# EAGLE design EnsembleSeven (EAGLE 7.6.0)
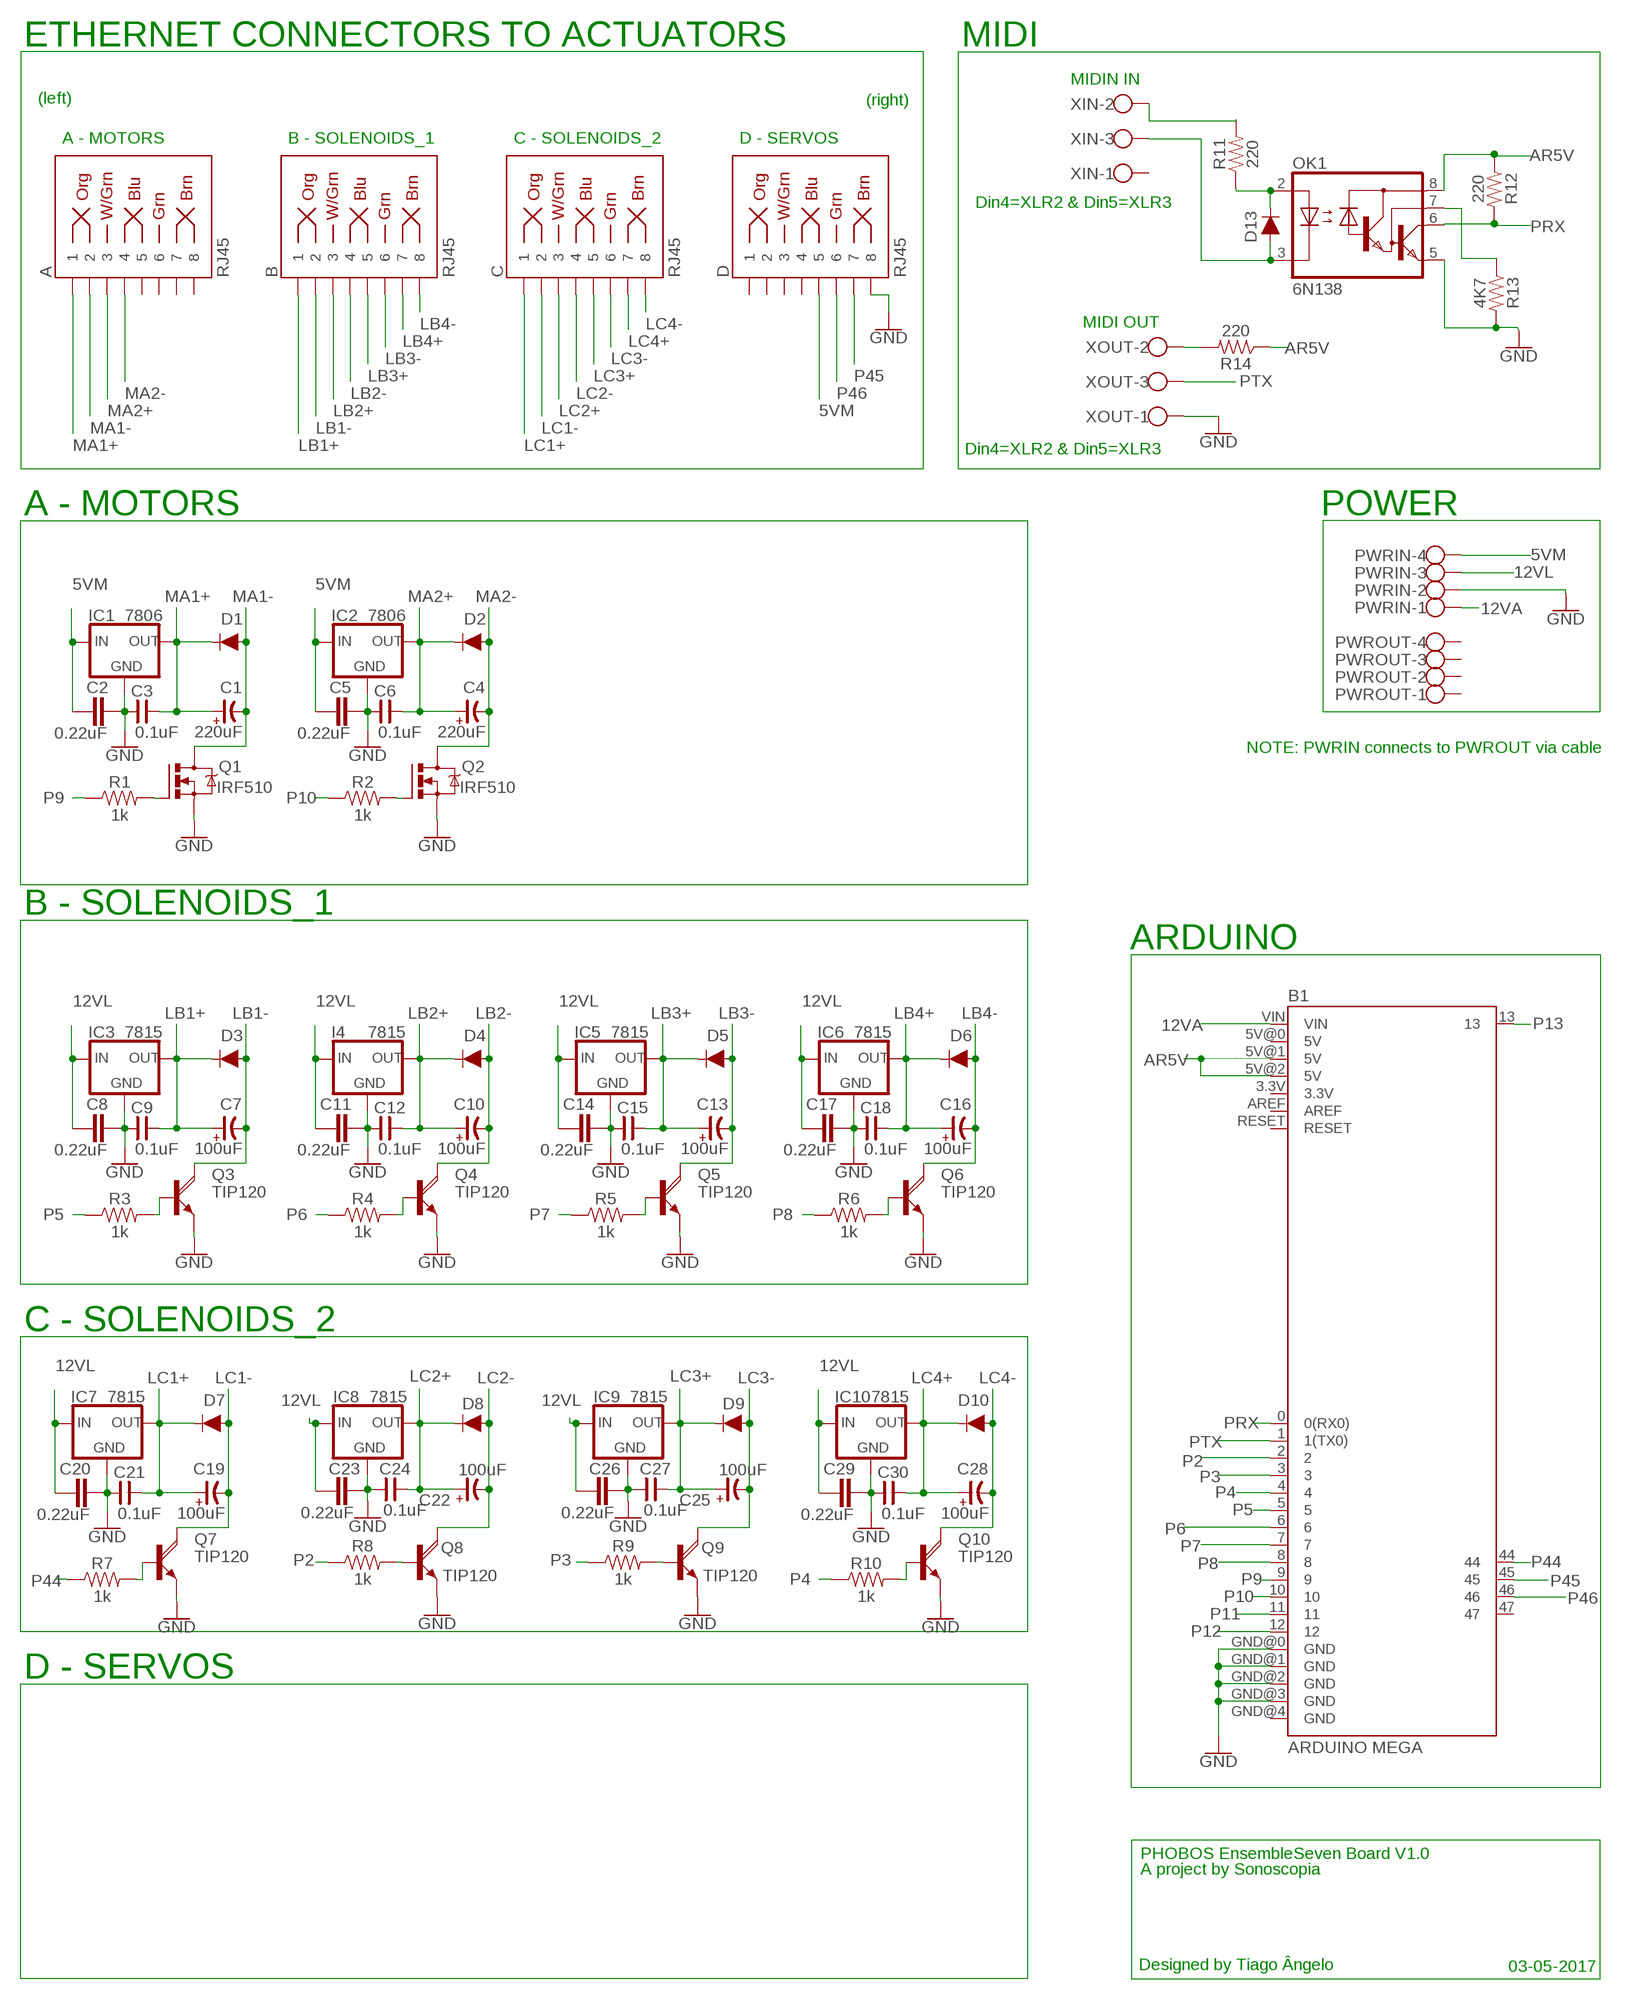
[diagram p0: schematic, sheet 1]

## Parts
A  RJ45  RJ45-8  [RJ45-8]
B  RJ45  RJ45-8  [RJ45-8]
B1  ARDUINO MEGA  ARDUINO_MEGA_R3FULL  [ARDUINO_MEGA]
C  RJ45  RJ45-8  [RJ45-8]
C1  220uF  CP-E-035X080  [E-035X080]
C2  0.22uF  C5/3  [C5B3]
C3  0.1uF  CNP-C025-050X025  [C025-050X025]
C4  220uF  CP-E-035X080  [E-035X080]
C5  0.22uF  C5/3  [C5B3]
C6  0.1uF  CNP-C025-050X025  [C025-050X025]
C7  100uF  CAP-MASTER_CP-E-020X050  [CAP-MASTER_E-020X050]
C8  0.22uF  C5/3  [C5B3]
C9  0.1uF  CNP-C025-050X025  [C025-050X025]
C10  100uF  CAP-MASTER_CP-E-020X050  [CAP-MASTER_E-020X050]
C11  0.22uF  C5/3  [C5B3]
C12  0.1uF  CNP-C025-050X025  [C025-050X025]
C13  100uF  CAP-MASTER_CP-E-020X050  [CAP-MASTER_E-020X050]
C14  0.22uF  C5/3  [C5B3]
C15  0.1uF  CNP-C025-050X025  [C025-050X025]
C16  100uF  CAP-MASTER_CP-E-020X050  [CAP-MASTER_E-020X050]
C17  0.22uF  C5/3  [C5B3]
C18  0.1uF  CNP-C025-050X025  [C025-050X025]
C19  100uF  CAP-MASTER_CP-E-020X050  [CAP-MASTER_E-020X050]
C20  0.22uF  C5/3  [C5B3]
C21  0.1uF  CNP-C025-050X025  [C025-050X025]
C22  100uF  CP-E-020X050  [E-020X050]
C23  0.22uF  C5/3  [C5B3]
C24  0.1uF  CNP-C025-050X025  [C025-050X025]
C25  100uF  CP-E-020X050  [E-020X050]
C26  0.22uF  C5/3  [C5B3]
C27  0.1uF  CNP-C025-050X025  [C025-050X025]
C28  100uF  CAP-MASTER_CP-E-020X050  [CAP-MASTER_E-020X050]
C29  0.22uF  C5/3  [C5B3]
C30  0.1uF  CNP-C025-050X025  [C025-050X025]
D  RJ45  RJ45-8  [RJ45-8]
D1  1A/50V/1.1V  DIODE-KIT2  [DIODE-1N4001-KIT]
D2  1A/50V/1.1V  DIODE-KIT2  [DIODE-1N4001-KIT]
D3  1A/50V/1.1V  DIODE-KIT2  [DIODE-1N4001-KIT]
D4  1A/50V/1.1V  DIODE-KIT2  [DIODE-1N4001-KIT]
D5  1A/50V/1.1V  DIODE-KIT2  [DIODE-1N4001-KIT]
D6  1A/50V/1.1V  DIODE-KIT2  [DIODE-1N4001-KIT]
D7  1A/50V/1.1V  DIODE-KIT2  [DIODE-1N4001-KIT]
D8  1A/50V/1.1V  DIODE-KIT2  [DIODE-1N4001-KIT]
D9  1A/50V/1.1V  DIODE-KIT2  [DIODE-1N4001-KIT]
D10  1A/50V/1.1V  DIODE-KIT2  [DIODE-1N4001-KIT]
D13  200mA/100V/1V  DIODE-1N4148  [DIODE-1N4148]
I4  7815  78XXS  [78XXS]
IC1  7806  78XXS  [78XXS]
IC2  7806  78XXS  [78XXS]
IC3  7815  78XXS  [78XXS]
IC5  7815  78XXS  [78XXS]
IC6  7815  78XXS  [78XXS]
IC7  7815  78XXS  [78XXS]
IC8  7815  78XXS  [78XXS]
IC9  7815  78XXS  [78XXS]
IC10  7815  78XXS  [78XXS]
OK1  6N138  [DIL08]
PWRIN  W237-4  [W237-4]
PWROUT  W237-4  [W237-4]
Q1  IRF510  IRF520  [TO220BV]
Q2  IRF510  IRF520  [TO220BV]
Q3  TIP120  ROCKETFARM_TIP120V  [ROCKETFARM_TO220AV]
Q4  TIP120  ROCKETFARM_TIP120V  [ROCKETFARM_TO220AV]
Q5  TIP120  ROCKETFARM_TIP120V  [ROCKETFARM_TO220AV]
Q6  TIP120  ROCKETFARM_TIP120V  [ROCKETFARM_TO220AV]
Q7  TIP120  ROCKETFARM_TIP120V  [ROCKETFARM_TO220AV]
Q8  TIP120  TIP120V  [TO220AV]
Q9  TIP120  TIP120V  [TO220AV]
Q10  TIP120  ROCKETFARM_TIP120V  [ROCKETFARM_TO220AV]
R1  1k  1KOHM-VERT-1/4W-1%  [AXIAL-0.1]
R2  1k  1KOHM-VERT-1/4W-1%  [AXIAL-0.1]
R3  1k  1KOHM-VERT-1/4W-1%  [AXIAL-0.1]
R4  1k  1KOHM-VERT-1/4W-1%  [AXIAL-0.1]
R5  1k  1KOHM-VERT-1/4W-1%  [AXIAL-0.1]
R6  1k  1KOHM-VERT-1/4W-1%  [AXIAL-0.1]
R7  1k  1KOHM-VERT-1/4W-1%  [AXIAL-0.1]
R8  1k  1KOHM-VERT-1/4W-1%  [AXIAL-0.1]
R9  1k  1KOHM-VERT-1/4W-1%  [AXIAL-0.1]
R10  1k  1KOHM-VERT-1/4W-1%  [AXIAL-0.1]
R11  220  1KOHM-HORIZ-1/4W-5%  [AXIAL-0.3]
R12  220  1KOHM-HORIZ-1/4W-5%  [AXIAL-0.3]
R13  4K7  1KOHM-HORIZ-1/4W-5%  [AXIAL-0.3]
R14  220  1KOHM-HORIZ-1/4W-5%  [AXIAL-0.3]
XIN  W237-103  [W237-103]
XOUT  W237-103  [W237-103]

## Nets
5VM [5VM]: C2.1 C5.1 D.5 IC1.IN IC2.IN PWRIN.4
12VA [12VA]: B1.VIN PWRIN.1
12VL [12VL]: C8.1 C11.1 C14.1 C17.1 C20.1 C23.1 C26.1 C29.1 I4.IN IC3.IN IC5.IN IC6.IN IC7.IN IC8.IN IC9.IN IC10.IN PWRIN.3
AR5V: B1.5V@1(5V) B1.5V@2(5V) OK1.8(VCC) R12.P$1 R14.P$1
GND [GND]: B1.GND@0(GND) B1.GND@1(GND) B1.GND@2(GND) B1.GND@3(GND) C2.2 C3.1 C5.2 C6.1 C8.2 C9.1 C11.2 C12.1 C14.2 C15.1 C17.2 C18.1 C20.2 C21.1 C23.2 C24.1 C26.2 C27.1 C29.2 C30.1 D.8 I4.GND IC1.GND IC2.GND IC3.GND IC5.GND IC6.GND IC7.GND IC8.GND IC9.GND IC10.GND OK1.5(GND) PWRIN.2 Q1.S Q2.S Q3.E Q4.E Q5.E Q6.E Q7.E Q8.E Q9.E Q10.E R13.P$2 XOUT.1
LB1+: B.1 C7.+ C9.2 D3.C IC3.OUT
LB1-: B.2 C7.- D3.A Q3.C
LB2+: B.3 C10.+ C12.2 D4.C I4.OUT
LB2-: B.4 C10.- D4.A Q4.C
LB3+: B.5 C13.+ C15.2 D5.C IC5.OUT
LB3-: B.6 C13.- D5.A Q5.C
LB4+: B.7 C16.+ C18.2 D6.C IC6.OUT
LB4-: B.8 C16.- D6.A Q6.C
LC1+: C19.+ C21.2 C.1 D7.C IC7.OUT
LC1-: C19.- C.2 D7.A Q7.C
LC2+: C22.+ C24.2 C.3 D8.C IC8.OUT
LC2-: C22.- C.4 D8.A Q8.C
LC3+: C25.+ C27.2 C.5 D9.C IC9.OUT
LC3-: C25.- C.6 D9.A Q9.C
LC4+: C28.+ C30.2 C.7 D10.C IC10.OUT
LC4-: C28.- C.8 D10.A Q10.C
MA1+: A.1 C1.+ C3.2 D1.C IC1.OUT
MA1-: A.2 C1.- D1.A Q1.D
MA2+: A.3 C4.+ C6.2 D2.C IC2.OUT
MA2-: A.4 C4.- D2.A Q2.D
N$1: Q5.B R5.P$2
N$2: R14.P$2 XOUT.2
N$3: Q6.B R6.P$2
N$4: Q9.B R9.P$2
N$9: Q8.B R8.P$2
N$14: Q1.G R1.P$2
N$15: Q2.G R2.P$2
N$16: Q10.B R10.P$2
N$18: Q3.B R3.P$2
N$19: Q4.B R4.P$2
N$20: Q7.B R7.P$2
N$25: D13.A OK1.3(C) XIN.3
N$26: D13.C OK1.2(A) R11.P$1
N$27: R11.P$2 XIN.2
N$29: OK1.7(VB) R13.P$1
P2: B1.2 R8.P$1
P3: B1.3 R9.P$1
P4: B1.4 R10.P$1
P5: B1.5 R3.P$1
P6: B1.6 R4.P$1
P7: B1.7 R5.P$1
P8: B1.8 R6.P$1
P9: B1.9 R1.P$1
P10: B1.10 R2.P$1
P11: B1.11
P12: B1.12
P13: B1.13
P44: B1.44 R7.P$1
P45: B1.45 D.7
P46: B1.46 D.6
PRX: B1.0(0(RX0)) OK1.6(VO) R12.P$2
PTX: B1.1(1(TX0)) XOUT.3
Unconnected: A.5 A.6 A.7 A.8 B1.3.3V B1.5V@0(5V) B1.47 B1.AREF B1.GND@4(GND) B1.RESET D.1 D.2 D.3 D.4 PWROUT.1 PWROUT.2 PWROUT.3 PWROUT.4 XIN.1

## Notes on the sheet
- ETHERNET CONNECTORS TO ACTUATORS | MIDI
- MIDIN IN
- (left) | (right)
- A - MOTORS | B - SOLENOIDS_1 | C - SOLENOIDS_2 | D - SERVOS
- Din4=XLR2 & Din5=XLR3
- MIDI OUT
- Din4=XLR2 & Din5=XLR3
- A - MOTORS | POWER
- NOTE: PWRIN connects to PWROUT via cable
- B - SOLENOIDS_1
- ARDUINO
- C - SOLENOIDS_2
- D - SERVOS
- PHOBOS EnsembleSeven Board V1.0
- A project by Sonoscopia
- Designed by Tiago Ângelo | 03-05-2017

## Library data of the parts
A B C D = SparkFun-Connectors:RJ45-8: RJ45 Jack - 8 pin Simple RJ45, 8-pin connection. Commonly used for Cat5, Cat5e, and Cat6 Ethernet cables. Here is the connector we sell at SparkFun: RJ45 8-Pin Connector <https://www.sparkfun.com/products/643> (PRT-00643) Datasheet <https://cdn.sparkfun.com/datasheets/Prototyping/04908.pdf> It is used on this SparkFun product: SparkFun RJ45 Breakout <https://www.sparkfun.com/products/716> (BOB-00716) Note, you may also be interested in the "MAGJACK" version of this. It is basically a RJ45 connector, but also has some status LEDs built into the connector housing. You can check that out in this library at the device named "MAGJACK.dev" and see these products online: RJ45 Ethernet MagJack-Compatible <https://www.sparkfun.com/products/8534> (PRT-08534) SparkFun RJ45 MagJack Breakout <https://www.sparkfun.com/products/13021> (BOB-13021); PROD_ID: CONN-08506; SF_ID: PRT-00643
B1 = PHOBOS-Boards:ARDUINO_MEGA_R3: Arduino Mega R3 ATmega2560 R3 compatible footprint. SparkFun Products: Arduino Mega 2560 R3 <https://www.sparkfun.com/products/11061>
C1 C4 C22 C25 = cap-master:CP-: POLARIZED CAP
C2 C5 C8 C11 C14 C17 C20 C23 C26 C29 = capacitor-wima:C: CAPACITOR naming: grid - package width
C3 C6 C9 C12 C15 C18 C21 C24 C27 C30 = cap-master:CNP-: NON-POLARIZED CAP
C7 C10 C13 C16 C19 C28 = PHOBOS-lbr:CAP-MASTER_CP-: POLARIZED CAP
D1-D10 = SparkFun-DiscreteSemi:DIODE: Diode These are standard reverse protection diodes and small signal diodes. SparkFun Products: SparkFun SparkPunk Sound Kit <https://www.sparkfun.com/products/11177> SparkFun ESP8266 Thing <https://www.sparkfun.com/products/13231>; PROD_ID: DIO-09176
D13 = SparkFun-DiscreteSemi:DIODE: Diode These are standard reverse protection diodes and small signal diodes. SparkFun Products: SparkFun SparkPunk Sound Kit <https://www.sparkfun.com/products/11177> SparkFun ESP8266 Thing <https://www.sparkfun.com/products/13231>; PROD_ID: DIO-08378
I4 IC1-IC3 IC5-IC10 = v-reg:78XXS: VOLTAGE REGULATOR
OK1 = optocoupler:6N138: MOTOROLA OPTO COUPLER; MF: VISHAY/TELEFUNKEN; MPN: 6N138; OC_FARNELL: 9860150; OC_NEWARK: 35K5294
PWRIN PWROUT = con-wago-500:W237-4: WAGO SCREW CLAMP; OC_FARNELL: unknown; OC_NEWARK: unknown
Q1 Q2 = transistor-power:IRF520: HEXFET Power MOSFET
Q3-Q7 Q10 = PHOBOS-lbr:ROCKETFARM_TIP120: NPN DARLINGTON TRANSISTOR
Q8 Q9 = rocketfarm:TIP120: NPN DARLINGTON TRANSISTOR
R1-R10 = SparkFun-Resistors:1KOHM: 1kΩ resistor A resistor is a passive two-terminal electrical component that implements electrical resistance as a circuit element. Resistors act to reduce current flow, and, at the same time, act to lower voltage levels within circuits. - Wikipedia; PROD_ID: RES-12182
R11-R14 = SparkFun-Resistors:1KOHM: 1kΩ resistor A resistor is a passive two-terminal electrical component that implements electrical resistance as a circuit element. Resistors act to reduce current flow, and, at the same time, act to lower voltage levels within circuits. - Wikipedia; PROD_ID: RES-08380; VALUE: 1k
XIN XOUT = con-wago-500:W237-103: WAGO SCREW CLAMP; MPN: 237-103; OC_FARNELL: unknown; OC_NEWARK: 18M7116

## Net classes
0 default: width 0.508 mm, drill 0.508 mm, clearance 0.406 mm
1 GND: width 1.016 mm, drill 0.508 mm, clearance 0.508 mm
2 5VM: width 1.016 mm, drill 0.508 mm, clearance 0.508 mm
3 12VL: width 0.61 mm, drill 0.508 mm, clearance 0.508 mm
4 12VA: width 0.508 mm, drill 0.508 mm, clearance 0.508 mm

## Board
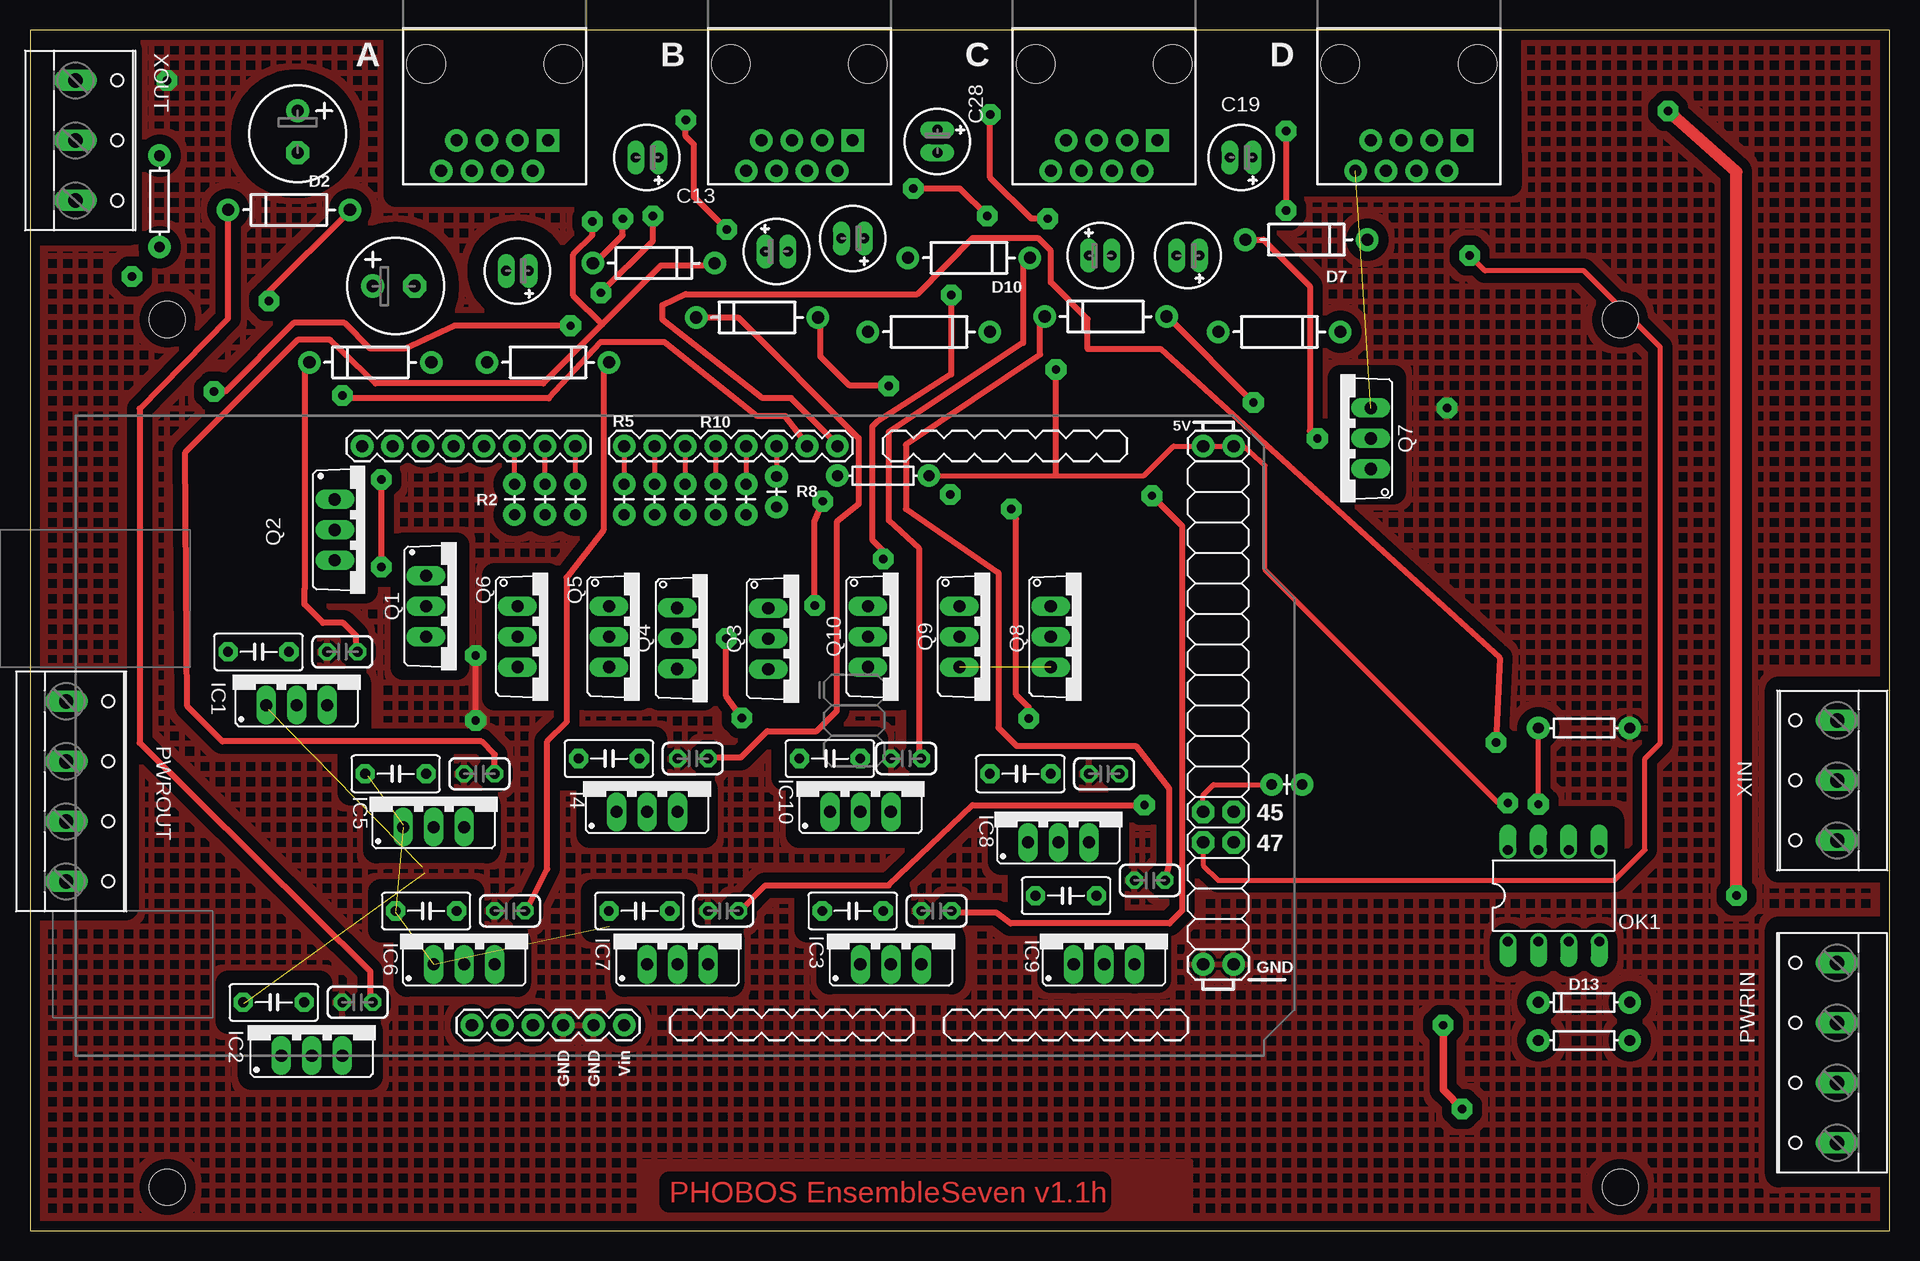
[diagram p1: board, top side]
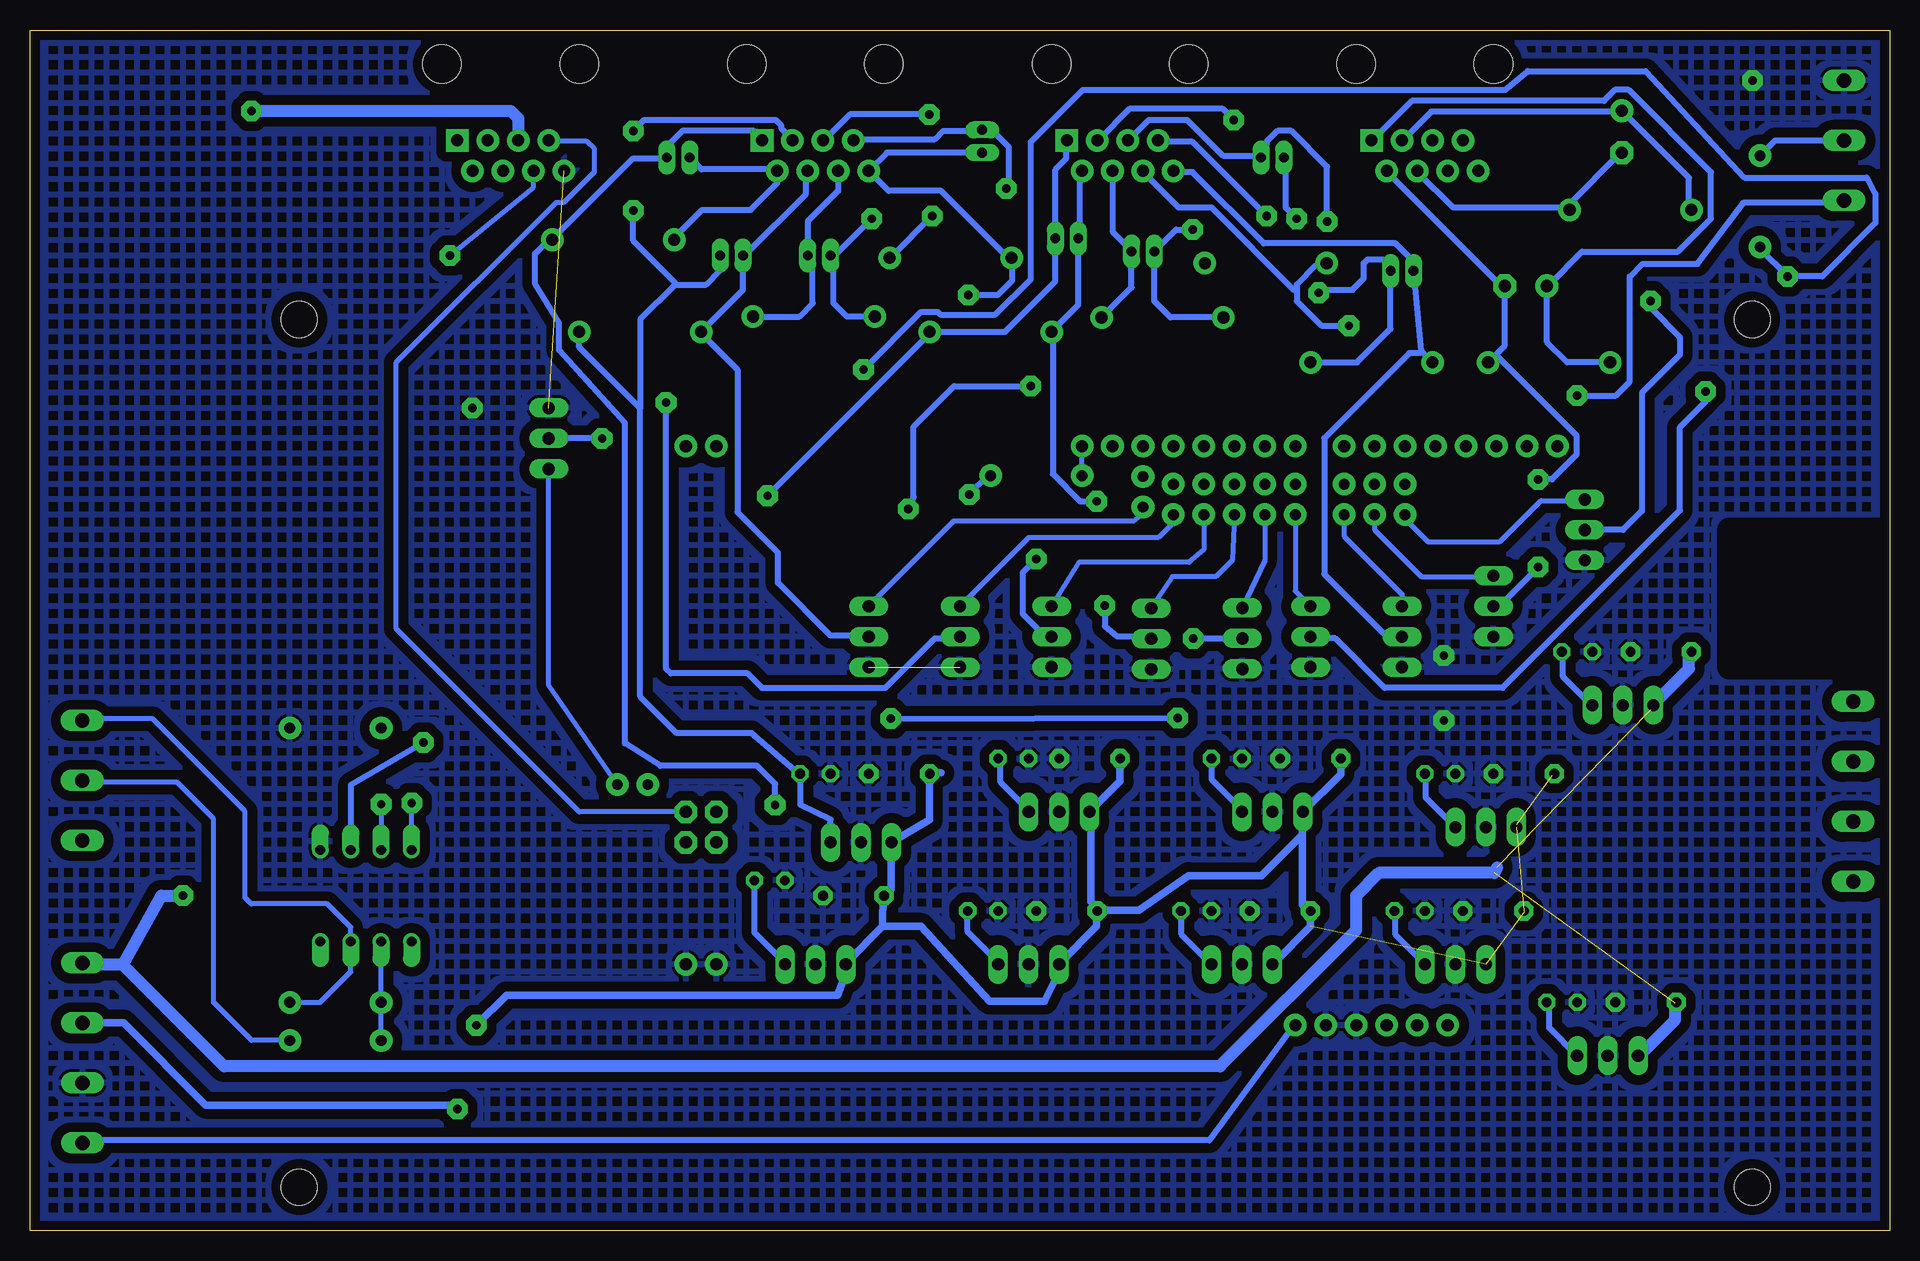
[diagram p2: board, bottom side, seen from below]

Size 155 x 100.08 mm. Coordinates in mm from the lower left corner, seen from the top.
Outline: 0,0 155,0 155,100.08 0,100.08 0,0
Copper layers (1*16): Top 0.035mm / dielectric 1.5mm / Bottom 0.035mm
Design rules "Dek": minimum track width 12mil, minimum drill 36mil, track to track 12mil, track to pad 12mil, pad to pad 12mil, via to via 12mil, smd to smd 0mil, copper to edge 10mil, drill to drill 12mil, minimum pad ring 12mil, minimum via ring 20mil, stop-mask expansion 4mil, vias tented up to drill 25mil, thermal gap 10mil
Holes 3 mm at 132.55,75.95 132.55,3.65 11.45,3.65 11.45,75.95
Holes 1.5 mm at -15.24,52.07 193.04,6.35 193.04,93.98
tRestrict: area 30.5,86.4 to 47,108; area 55.9,86.4 to 72.4,108; area 81.3,87.2 to 97.8,108; area 106.7,87.2 to 123.4,108; area 122.2,30.8 to 131.8,34.3; area 0,27 to 7.9,45.7; area 145.7,4.8 to 154.6,25.1; area 145.7,30.2 to 154.9,45.1; area 49.5,20.6 to 58.4,24.4; area 66.7,20.8 to 76.8,24.4; area 85.1,20.9 to 94,24.1; area 81,30.8 to 90.5,34.3; 38 more areas
bRestrict: area -2.5,47 to 13.3,58.4
vRestrict: area 71.1,64.1 to 91.4,66.7; area 96.5,36.2 to 101.6,64.1; area 96.5,23.5 to 101.6,31.1; area 53.3,15.9 to 73.7,18.4; area 76.2,15.9 to 96.5,18.4; area -2.5,47 to 13.3,58.4; area 122.2,25.1 to 132.1,30.8; area 10.2,83.2 to 11.4,88.3; area 18.5,83.9 to 24.7,86.3; area 25.2,71.2 to 31.5,73.6; area 40.1,71.2 to 46.3,73.6; area 57.6,74.8 to 63.6,77.4; 8 more areas

### Footprints (pad centres in the part's own frame; a part is rotated, then mirrored left to right if it is on the bottom)
RJ45-8 = drill 1 pad 1.88 square: 1 -4.445,6.35 | drill 1 pad 1.88: 2 -3.175,8.89; 3 -1.905,6.35; 4 -0.635,8.89; 5 0.635,6.35; 6 1.905,8.89; 7 3.175,6.35; 8 4.445,8.89 | hole 3.2: -5.715,0; 5.715,0
ARDUINO_MEGA = drill 1.016 pad 1.88: 0 13.97,24.13; 1 11.43,24.13; 2 8.89,24.13; 3 6.35,24.13; 3.3V -13.97,-24.13; 4 3.81,24.13; 5 1.27,24.13; 5V@0 -11.43,-24.13; 5V@1 44.45,24.13; 5V@2 46.99,24.13; 6 -1.27,24.13; 7 -3.81,24.13; 8 -7.874,24.13; 9 -10.414,24.13; 10 -12.954,24.13; 11 -15.494,24.13; 12 -18.034,24.13; 13 -20.574,24.13; AREF -25.654,24.13; GND@0 -8.89,-24.13; GND@1 -6.35,-24.13; GND@2 44.45,-19.05; GND@3 46.99,-19.05; GND@4 -23.114,24.13; RESET -16.51,-24.13; VIN -3.81,-24.13 | drill 1.016 pad 1.88 octagon: 44 44.45,-6.35; 45 46.99,-6.35; 46 44.45,-8.89; 47 46.99,-8.89
E-035X080 = drill 1.016 pad 1.93: + -1.905,0 | drill 1.016 pad 1.93 octagon: - 1.587,0
C5B3 = drill 0.813 pad 1.6 octagon: 1 -2.54,0; 2 2.54,0
C025-050X025 = drill 0.813 pad 1.422 octagon: 1 -1.27,0; 2 1.27,0
CAP-MASTER_E-020X050 = drill 0.813 long: + -0.953,0; - 0.953,0
E-020X050 = drill 0.813 long: + -0.953,0; - 0.953,0
DIODE-1N4001-KIT = drill 1.016 pad 1.88: A -5.08,0; C 5.08,0
DIODE-1N4148 = drill 0.9 pad 1.88: A -3.81,0; C 3.81,0
78XXS = drill 1.016 long: GND 0,-2.54; IN -2.54,-2.54; OUT 2.54,-2.54
DIL08 = drill 0.813 offset: 1 -3.81,-3.81; 2 -1.27,-3.81; 3 1.27,-3.81; 4 3.81,-3.81; 5 3.81,3.81; 6 1.27,3.81; 7 -1.27,3.81; 8 -3.81,3.81
W237-4 = drill 1.194 long: 1 -7.5,-1.27; 2 -2.5,-1.27; 3 2.5,-1.27; 4 7.5,-1.27
TO220BV = drill 1.016 long: D 0,-2.54; G -2.54,-2.54; S 2.54,-2.54
ROCKETFARM_TO220AV = drill 1.016 long: B -2.54,-2.54; C 0,-2.54; E 2.54,-2.54
TO220AV = drill 1.016 long: B -2.54,-2.54; C 0,-2.54; E 2.54,-2.54
AXIAL-0.1 = drill 0.9 pad 1.88: P$1 -1.27,0; P$2 1.27,0
AXIAL-0.3 = drill 0.9 pad 1.88: P$1 -3.81,0; P$2 3.81,0
W237-103 = drill 1.194 long: 1 -5,-1.29; 2 0,-1.29; 3 5,-1.29

### Placement (x,y rotation side)
A  38.73,97.23 180 top
B  64.13,97.23 180 top
B1  53.34,41.27 0 top
C  89.53,97.23 180 top
C1  30.48,78.74 0 top
C2  19.05,48.26 0 top
C3  26.03,48.26 0 top
C4  22.3,91.44 270 top
C5  20.32,19.05 0 top
C6  27.3,19.05 0 top
C7  68.58,82.72 180 top
C8  68.58,26.67 0 top
C9  75.56,26.67 0 top
C10  62.23,81.62 0 top
C11  48.26,39.37 0 top
C12  55.24,39.37 0 top
C13  51.43,89.46 180 top
C14  30.48,38.1 0 top
C15  37.46,38.1 0 top
C16  40.64,80.01 180 top
C17  33.02,26.67 0 top
C18  40.01,26.67 0 top
C19  100.97,89.46 180 top
C20  50.8,26.67 0 top
C21  57.79,26.67 0 top
C22  96.52,81.28 180 top
C23  82.55,38.1 0 top
C24  89.53,38.1 0 top
C25  89.22,81.28 0 top
C26  86.36,27.94 0 top
C27  93.34,29.21 0 top
C28  75.64,90.81 270 top
C29  66.68,39.37 0 top
C30  73.03,39.37 0 top
D  114.94,97.23 180 top
D1  28.37,72.38 180 top
D2  21.59,85.09 180 top
D3  74.93,74.93 0 top
D4  60.6,76.12 180 top
D5  51.99,80.64 0 top
D6  43.18,72.39 0 top
D7  106.39,82.6 0 top
D8  104.14,74.93 0 top
D9  89.66,76.2 180 top
D10  78.26,81.1 0 top
D13  129.54,19.05 180 top
I4  51.43,37.47 0 top
IC1  22.23,46.35 0 top
IC2  23.49,17.14 0 top
IC3  71.75,24.77 0 top
IC5  33.66,36.2 0 top
IC6  36.2,24.77 0 top
IC7  53.98,24.77 0 top
IC8  85.72,34.92 0 top
IC9  89.53,24.77 0 top
IC10  69.22,37.47 0 top
OK1  127,27.94 0 top
PWRIN  149.35,14.84 90 top
PWROUT  4.3,36.63 270 top
Q1  35.56,52.07 270 top
Q2  27.94,58.42 270 top
Q3  64.08,49.36 270 top
Q4  56.49,49.38 270 top
Q5  50.8,49.53 270 top
Q6  43.18,49.53 270 top
Q7  109.22,66.04 90 top
Q8  87.63,49.53 270 top
Q9  80.01,49.53 270 top
Q10  72.39,49.53 270 top
R1  42.93,60.96 270 top
R2  40.39,60.96 270 top
R3  54.61,60.96 270 top
R4  52.07,60.96 270 top
R5  49.53,60.96 270 top
R6  45.47,60.96 270 top
R7  104.78,37.21 0 top
R8  62.23,61.59 270 top
R9  59.69,60.96 270 top
R10  57.15,60.96 270 top
R11  129.54,15.88 0 top
R12  71.12,62.94 180 top
R13  129.54,41.91 0 top
R14  10.79,85.8 90 top
XIN  149.35,37.54 90 top
XOUT  5.08,90.88 270 top

### Tracks (layer width: path | path; a pad name or v marks a point on that pad's centre or on a via)
5VM  (via drill 0.7)  (2 unrouted)
  Top 1.016: v142.24,27.94 142.24,88.27 v136.53,93.34
  Bottom 1.016: C5.1 17.86,18.97 17.86,17.6 20.83,14.63 IC2.IN | C2.1 16.71,48.23 16.71,46.86 19.69,43.89 IC1.IN 19.91,43.43 | 147.27,22.17 150.44,22.17 PWRIN.4 | 147.27,22.17 138.81,13.72 55.8,13.72 44.45,25.07 44.45,27.94 42.55,29.84 32.94,29.84 32.71,30.3 | 147.27,22.17 144.04,27.94 v142.24,27.94 | v136.53,93.34 114.94,93.34 114.3,92.71 D.5
12VA
  Bottom 0.508: PWRIN.1 150.44,7.54 56.69,7.54 49.63,17.14 B1.VIN
12VL  (via drill 0.7)  (4 unrouted)
  Top 0.61: v119.38,10.16 117.79,11.75 v117.79,17.14
  Bottom 0.61: 64.49,39.22 C29.1 64.13,37.47 IC10.IN 66.55,34.75 66.55,27.43 66.09,26.98 C8.1 | 83.92,25.38 83.92,26.52 C26.1 83.69,28.02 83.24,28.47 83.24,32.23 IC8.IN 80.03,34.27 80.03,37.95 C23.1 79.81,38.18 79.06,38.18 | 83.92,25.38 86.89,22.4 IC9.IN 86.89,21.95 86.89,21.72 87.68,19.66 115.28,19.66 v117.79,17.14 | C8.1 66.09,26.52 66.09,25.38 69.06,22.4 IC3.IN 69.29,21.95 69.29,21.49 70.43,19.14 75.01,19.14 80.72,25.38 83.92,25.38 | C11.1 45.74,39.22 45.74,38.08 I4.IN 48.95,34.65 48.95,33.02 | IC7.IN 51.23,22.4 48.26,25.38 C20.1 48.49,26.75 48.95,27.2 48.95,33.02 | C8.1 65.86,26.75 62.56,26.75 58.42,29.62 52.35,29.62 48.95,33.02 | PWRIN.3 147.2,17.34 140.34,10.48 119.7,10.48 v119.38,10.16
  Bottom 1.016: 28.14,37.95 C14.1 | 31.12,33.83 IC5.IN | 30.43,26.62 C17.1
AR5V  (via drill 0.7)
  Top 0.406: R12.P$1 85.52,62.94 92.85,62.94 95.32,65.41 B1.5V@1 B1.5V@2 101.16,65.41 101.24,65.32 102.95,63.78 102.95,55.11 122.4,35.66 v123.18,35.66
  Top 0.508: 85.52,62.94 v85.52,71.78
  Bottom 0.406: OK1.8 v123.18,35.66
  Bottom 0.508: R14.P$1 10.79,81.86 v8.48,79.55 5.61,79.55 1.17,84 1.17,86.41 1.91,87.78 12.1,87.78 20.33,96.65 30.16,96.65 32.03,95.1 67.23,95.1 71.58,90.75 71.58,79.32 74.55,76.35 79.12,76.35 79.35,76.58 80.72,76.58 v85.52,71.78 | v76.72,61.38 75.16,62.94 R12.P$1
GND  (via drill 0.7)  (2 unrouted)
  Top 0.508: v37.15,42.55 v37.15,47.94
  other vias: 118.11,68.58 11.43,95.89
  pour Bottom (isolate 0.813, rank 2, hatched): -5.08,104.14 160.02,104.14 160.02,0 -5.08,0
  pour Top (isolate 0.813, hatched): 0,100.33 154.94,100.33 154.94,0 0,0
LB1+  (via drill 0.7)
  Top 0.508: v93.52,61.27 96.04,58.75 96.04,26.7 94.98,25.64 81.74,25.64 80.54,26.52 76.84,26.52 C9.2
  Bottom 0.508: C9.2 76.84,24.92 74.32,22.4 IC3.OUT | v93.52,61.27 80.03,74.75 D3.C 73.73,74.93 69.53,79.13 C7.+ 69.52,81.61 69.52,88.47 68.6,89.38 68.6,90.75 B.1
LB1-  (via drill 0.7)
  Top 0.508: v65.41,52.12 65.38,59.1 v66.09,60.81
  Bottom 0.508: v66.09,60.81 67.46,60.81 69.75,63.09 69.75,74.75 D3.A 67.63,77.15 C7.- 67.46,81.61 67.46,88.24 B.2 | 62.36,49.66 Q3.C 62.25,49.55 64.38,49.55 65.41,50.41 v65.41,52.12
LB2+  (via drill 0.7)
  Top 0.508: D4.C 59,76.12 69.06,66.06 69.06,60.58 67.23,59.09 67.23,43.32 65.58,41.66 61.45,41.66 59.23,39.45 56.72,39.45 C12.2 | v54.66,92.58 54.66,91.21 55.35,90.53 55.35,86.18 v58.09,83.44
  Bottom 0.508: D4.C 59.92,76.12 61.29,77.5 61.29,81.27 C10.+ 59.46,83.44 v58.09,83.44 | C12.2 56.49,39.22 56.49,37.62 53.98,35.1 I4.OUT | v54.66,92.58 55.57,93.5 63.35,93.5 65.86,90.98 B.3
LB2-  (via drill 0.7)
  Top 0.508: v83.24,42.69 83.24,43.66 82.21,44.69 82.21,59.32 81.81,59.72 v81.81,60.18 | D4.A 65.86,76.12 65.86,72.89 68.26,70.48 71.5,70.48 v71.58,70.41 | v59.32,42.76 58.03,44.56 v58.03,49.38
  Bottom 0.508: D4.A 63.18,78.63 C10.- 63.35,81.84 64.72,83.21 64.72,88.24 B.4 | v83.24,42.69 v59.32,42.76 | v81.81,60.18 81.35,61.15 81.35,67.04 77.98,70.41 v71.58,70.41 | v58.03,49.38 Q4.C
LB3+  (via drill 0.7)
  Top 0.508: 47.69,75.55 52.6,80.47 56.9,80.47 D5.C 56.95,80.47 | 47.69,75.55 42.77,70.64 28.8,70.64 25.03,74.26 22.31,74.26 12.94,64.89 13.11,43.72 16.03,40.8 37.63,40.8 38.73,39.7 C15.2 | v46.89,84.12 46.89,82.98 45.29,81.38 45.29,77.95 47.69,75.55
  Bottom 0.508: IC5.OUT 38.66,36.12 38.66,37.95 C15.2 | B.5 63.35,90.98 61.75,92.58 58.55,92.58 55.57,89.61 52.6,89.61 C13.+ 52.6,89.84 51.92,90.53 51.92,90.75 51,91.67 49.86,91.67 46.89,88.7 v46.89,84.12
LB3-  (via drill 0.7)
  Top 0.508: v49.4,84.35 49.4,82.98 47.12,80.7 D5.A | v15.34,69.95 16.26,69.95 21.97,75.67 26.23,75.67 28.37,73.52 31.22,73.52 35.36,75.44 v45.06,75.44
  Bottom 0.508: v49.4,84.35 50.32,85.27 50.32,89.38 C13.- | v45.06,75.44 47.35,75.44 49.4,77.5 49.4,78.41 | 49.4,78.41 49.4,78.87 47.8,80.47 47.12,80.47 D5.A | Q5.C 48.26,49.38 46.2,49.38 42.09,45.26 32.26,45.26 17.46,60.06 17.46,66.99 15.34,69.11 v15.34,69.95 | B.6 62.21,88.24 59.23,85.27 56.49,85.27 49.63,78.41 49.4,78.41
LB4+  (via drill 0.7)
  Top 0.508: C18.2 41.4,26.75 43.12,30.18 43.12,40.8 44.72,42.41 44.72,54.45 47.8,58.4 47.8,71.78 48.26,72.24 D6.C | v51.92,84.58 51.92,82.53 v47.57,78.18
  Bottom 0.508: D6.C 44.38,72.39 41.59,75.18 C16.+ 41.59,80.33 42.23,80.96 43.5,80.96 43.82,80.64 43.82,79.38 44.77,78.42 47.33,78.42 v47.57,78.18 | C18.2 41.17,26.52 41.17,24.69 38.89,22.4 IC6.OUT | v51.92,84.58 58.09,90.75 60.83,90.75 B.7
LB4-
  Bottom 0.508: 38.99,73.28 39.05,73.34 C16.- 39.8,80.24 39.8,80.92 41.17,82.3 52.15,82.3 58.09,88.24 59.69,88.24 B.8 | 38.99,73.28 D6.A | 38.99,73.28 39.12,73.15 40.03,73.15 47.12,66.06 47.12,54.74 42.23,49.85 40.96,49.85 Q6.C
LC1+  (via drill 0.7)
  Top 0.508: v92.89,35.48 78.57,35.48 71.58,28.8 61.29,28.8 59.23,26.75 C21.2
  Bottom 0.508: C21.2 59,26.52 59,24.69 56.72,22.4 IC7.OUT | v92.89,35.48 92.89,37.26 94.38,38.75 102.44,38.75 105.41,40.64 105.41,67.31 110.9,73.41 110.9,75.67 112.9,78.94 112.9,81.44 111.73,82.6 D7.C 111.35,82.75 104.72,89.38 101.98,89.38 C19.+ 101.75,89.61 101.75,90.53 100.61,91.67 94.67,91.67 93.98,90.98 C.1
LC1-  (via drill 0.7)
  Top 0.508: D7.A 102.82,82.6 106.68,78.74 106.68,66.67 v107.31,66.04
  Bottom 0.508: D7.A 101.29,82.75 98.96,85.09 94.93,85.09 92.71,87.31 C.2 92.84,88.47 99.02,88.47 C19.- | v107.31,66.04 Q7.C
LC2+  (via drill 0.7)
  Top 0.508: v104.72,85.04 v104.72,91.67
  Bottom 0.508: 101.24,78.87 98.67,78.87 97.47,80.06 C22.+ | IC8.OUT 88.26,34.29 90.78,35.53 90.78,37.95 C24.2 91.01,38.18 94.61,41.26 94.84,41.49 101.1,41.49 104.14,44.53 104.14,68.58 | 101.24,78.87 104.14,75.97 104.14,68.58 | 104.14,68.58 109.22,73.66 D8.C | v104.72,91.67 103.81,92.58 92.84,92.58 92.38,92.13 92.38,91.9 91.47,90.98 C.3 | v104.72,85.04 104.72,82.53 101.29,79.1 101.24,78.87
LC2-
  Bottom 0.508: Q8.C 85.29,49.61 88.26,49.61 92.67,54.01 92.67,56.52 96.04,59.89 96.04,71.78 99.01,74.75 D8.A 95.57,78.42 C22.- 95.35,81.38 90.32,86.41 90.32,88.24 C.4
LC3+  (via drill 0.7)
  Top 0.508: C27.2 94.95,30.59 94.95,36.89 92.18,40.42 82.23,40.42 80.72,41.94 80.72,54.86 73.01,60.18 73.01,65.51 84.21,73.04 84.21,75.83 D9.C 84.38,76.12 | v80.03,93.04 80.03,87.78 83.46,84.35 v84.84,84.35
  Bottom 0.508: D9.C 86.91,76.2 88.04,77.32 88.04,81.19 C25.+ 87.81,81.38 v84.84,84.35 | IC9.OUT 92.15,22.4 94.62,24.87 C27.2 | v80.03,93.04 86.66,93.04 88.72,90.98 C.5
LC3-  (via drill 0.7)
  Top 0.508: v101.98,69.04 94.89,76.12 D9.A
  Bottom 0.508: D9.A 90.88,76.2 89.75,77.32 89.75,81.18 C25.- 90.17,84.14 87.63,86.68 C.6 | Q9.C 77.52,49.38 79.58,49.38 83.69,45.26 93.98,45.26 95.18,46.46 101.58,46.46 101.98,46.86 v101.98,69.04
LC4+  (via drill 0.7)
  Top 0.508: C30.2 74.09,39.45 74.09,56.9 71.58,59.21 71.58,66.58 82.78,74.01 82.78,80.47 83.24,80.92 D10.C | v73.63,86.87 77.52,86.87 v79.81,84.58
  Bottom 0.508: C30.2 74.09,39.22 74.09,37.39 71.81,35.1 IC10.OUT | C.7 86.21,90.98 79.58,90.98 78.89,91.67 75.69,91.67 C28.+ 75.46,91.67 74.78,91.67 73.41,90.3 73.41,87.1 v73.63,86.87 | v79.81,84.58 83.24,81.15 D10.C
LC4-  (via drill 0.7)
  Top 0.508: v76.78,78.01 76.78,71.38 70.61,67.44 70.21,67.04 70.21,57.61 71.12,56.69 v71.12,56.01
  Bottom 0.508: v71.12,56.01 72.26,54.86 72.26,51.44 70.43,49.61 69.98,49.61 Q10.C | 73.41,80.92 D10.A | v76.78,78.01 74.32,78.01 73.12,79.21 73.12,81.03 D10.A | 75.46,89.84 C28.- 83.58,89.85 C.8 | D10.A 73.41,81.15 73.53,81.15 79.06,86.68 83.43,86.68 C.8 | 85.06,88.47 C.8
MA1+
  Top 0.508: C3.2 27.23,48.46 27.19,49.6 26.11,50.68 24.43,50.68 22.89,52.22 22.88,53.49 22.88,72.01 23.11,72.24 D1.C
  Bottom 0.508: D1.C 26.86,72.38 28.54,74.07 28.54,78.71 C1.+ 28.37,78.87 25.63,81.61 17.63,81.61 14.88,84.35 14.88,88.24 21.74,95.1 22.88,95.1 23.8,94.18 39.8,94.18 43,90.98 A.1 | C3.2 27.23,48.23 27.23,46.18 24.94,43.89 IC1.OUT
MA1-  (via drill 0.7)
  Top 0.508: v29.29,62.64 v29.29,55.32
  Bottom 0.508: v29.29,55.32 32.49,52.12 32.94,52.12 Q1.D | v29.29,62.64 28.14,62.64 26.09,64.69 26.09,66.29 32.71,72.92 D1.A 32.07,73.77 C1.- 32.26,78.64 41.86,88.24 A.2
MA2+
  Top 0.508: C6.2 28.37,19.2 28.37,21.64 9.14,40.67 9.14,68.54 16.51,76.05 D2.C
  Bottom 0.508: C6.2 28.37,18.97 28.37,16.92 26.09,14.63 IC2.OUT | A.3 40.49,90.98 38.2,93.27 22.43,93.27 C4.+ 16.71,87.76 16.71,85.27 D2.C
MA2-  (via drill 0.7)
  Top 0.508: v19.91,77.5 19.91,78.28 26.54,84.91 D2.A
  Bottom 0.508: 25.4,58.52 Q2.D 22.23,58.42 20.64,60.01 20.64,69.85 17.46,73.03 17.46,74.47 19.91,76.92 v19.91,77.5 | A.4 39.34,88.24 36.37,85.27 26.77,85.27 D2.A 26.77,85.5 22.43,89.84 C4.-
N$1
  Bottom 0.406: R5.P$2 49.53,53.34 Q5.B
N$2
  Bottom 0.508: R14.P$2 9.52,90.88 XOUT.2
N$3
  Bottom 0.406: R6.P$2 45.47,57.9 40.64,53.07 Q6.B
N$4
  Bottom 0.406: R9.P$2 59.69,59.04 60.95,57.78 71.76,57.78 Q9.B
N$6
  pour Top (isolate 0.813): 50.98,5.78 96.7,5.78 96.7,0.7 50.98,0.7
N$9
  Bottom 0.406: R8.P$2 62.23,59.75 63.01,59.15 78.01,59.15 Q8.B
N$14
  Bottom 0.406: R1.P$2 42.93,58.45 39,54.52 33.11,54.52 Q1.G
N$15
  Bottom 0.406: Q2.G 25.49,60.87 29.06,60.87 32.49,57.44 38.49,57.44 40.39,59.33 R2.P$2
N$16
  Bottom 0.406: R10.P$2 57.15,56.77 58.38,55.72 67.57,55.72 Q10.B
N$18
  Bottom 0.406: R3.P$2 54.78,55.89 56.15,54.52 59.78,54.52 Q3.B
N$19
  Bottom 0.406: R4.P$2 52.07,55.88 Q4.B
N$20
  Bottom 0.406: R7.P$2 111.76,45.47 Q7.B
N$25
  Bottom 0.406: D13.A 130.81,19.05 128.27,21.59 OK1.3 128.27,25.32 130.21,27.26 136.56,27.26 137.07,27.77 137.07,34.98 144.79,42.69 150.49,42.69 XIN.3
N$26
  Bottom 0.406: OK1.2 D13.C R11.P$1
N$27
  Bottom 0.406: R11.P$2 136.53,15.88 139.7,19.05 139.7,34.35 142.73,37.38 150.48,37.38 XIN.2
N$29  (via drill 0.7)
  Top 0.406: v125.73,35.56 R13.P$1
  Bottom 0.406: v125.73,35.56 OK1.7
P2
  Top 0.406: B1.2 R8.P$1
P3
  Top 0.406: B1.3 R9.P$1
P4
  Top 0.406: B1.4 R10.P$1
P5
  Top 0.406: B1.5 R3.P$1
P6
  Top 0.406: B1.6 R4.P$1
P7
  Top 0.406: B1.7 R5.P$1
P8
  Top 0.406: R6.P$1 B1.8
P9
  Top 0.406: R1.P$1 B1.9
P10
  Top 0.406: R2.P$1 B1.10
P44
  Top 0.406: B1.44 97.79,36.33 98.67,37.2 R7.P$1
P45
  Bottom 0.406: B1.45 109.22,34.92 124.46,50.16 124.46,72.39 111.12,85.72 110.49,85.72 107.95,88.27 107.95,90.17 108.59,90.81 111.69,90.81 D.7
P46  (via drill 0.7)
  Top 0.406: B1.46 97.79,30.48 99.06,29.21 132.08,29.21 134.62,31.75 134.62,39.37 135.89,40.64 135.89,73.66 129.54,80.01 121.28,80.01 v120.02,81.28
  Bottom 0.406: v120.02,81.28 113.03,87 D.6
PRX  (via drill 0.7)
  Top 0.508: v122.2,40.69 122.52,47.75 94.22,73.51 88.16,73.51 88.16,75.98 85.09,79.06 85.09,81.67 84,82.75 78.59,82.75 73.98,78.07 54.66,78.07 52.72,77.15 52.72,75.95 61.06,69.39 63.45,69.39 67.23,65.61 B1.0
  Bottom 0.406: R12.P$2 B1.0
  Bottom 0.508: OK1.6 128.27,37.16 v122.2,40.69
PTX  (via drill 0.7)
  Top 0.508: B1.1 64.72,65.61 62.95,67.89 60.6,67.89 52.89,74.07 47.57,74.07 43.23,69.38 26.26,69.38 v26.03,69.61
  Bottom 0.508: v26.03,69.61 22.83,69.61 21.66,70.77 21.66,79.53 20.6,80.59 16,80.59 12.14,85.72 3.91,85.72 XOUT.3

### Text on the board
Top: PHOBOS EnsembleSeven v1.1h
Document: (human fabrication)
tSilk: BOWLS | MEDALS | SHAKERS | WOOD